# Altium schematic sheet AntiStartingCrap.SchDoc
size A4
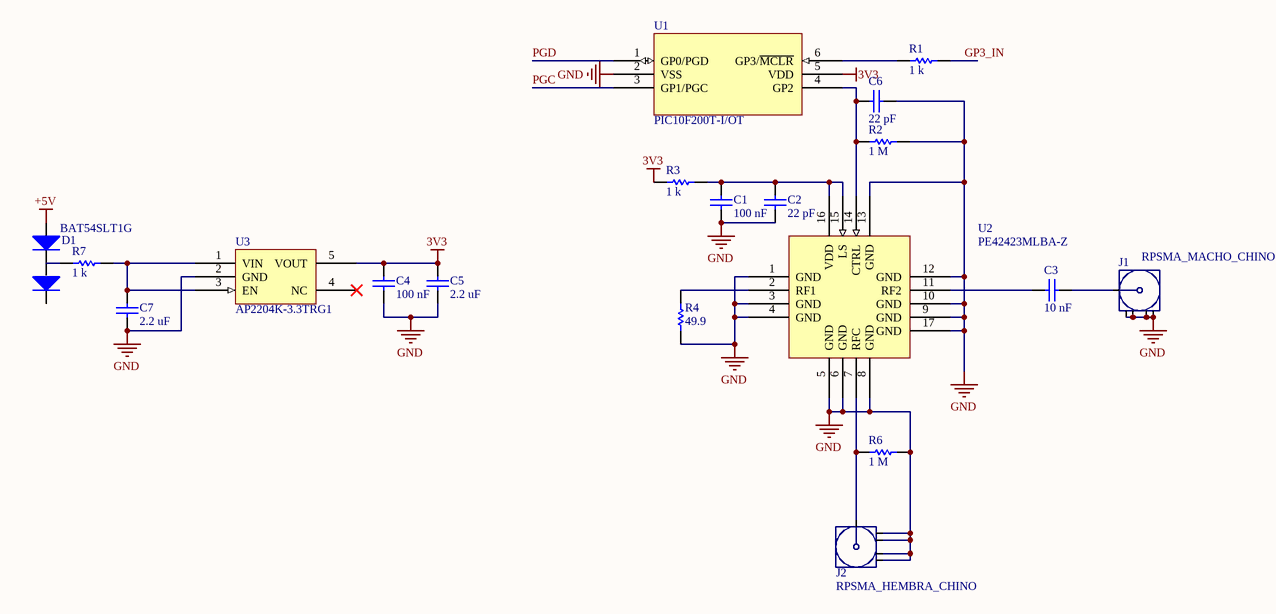
[diagram p0: AntiStartingCrap.SchDoc]

## Parts
C1  100 nF  [CAPC1608X10L]
C2  22 pF  [CAPC1608X10L]
C3  10 nF  [CAPC1608X10L]
C4  100 nF  [CAPC1608X10L]
C5  2.2 uF  [CAPC1608X10L]
C6  22 pF  [CAPC1608X10L]
C7  2.2 uF  [CAPC1608X10L]
D1  BAT54SLT1G  [SOT95P237X111-3N]
J1  RPSMA_MACHO_CHINO  [SMACHINO]
J2  RPSMA_HEMBRA_CHINO  [SMACHINO]
R1  1 k  [RESC1608X05N]
R2  1 M  [RESC1608X05N]
R3  1 k  [RESC1608X05N]
R4  49.9  [RESC1608X05N]
R6  1 M  [RESC1608X05N]
R7  1 k  [RESC1608X05N]
U1  PIC10F200T-I/OT  [SOT95P270X145-6N]
U2  PE42423MLBA-Z  [QFN50P300X300X90_HS-17N _PEREGRINE]
U3  AP2204K-3.3TRG1  [SOT95P270X145-5N]

## Nets
3V3: C4.2 C5.2 R3.1 U1.5(VDD) U3.5(VOUT)
+5V: D1.1(A)
GND: C1.1 C2.1 C4.1 C5.1 C6.1 C7.1 J1.2 J1.3 J1.4 J1.5 J2.2 J2.3 J2.4 J2.5 R2.2 R4.2 R6.2 U1.2(VSS) U2.1(GND) U2.3(GND) U2.4(GND) U2.5(GND) U2.6(GND) U2.8(GND) U2.9(GND) U2.10(GND) U2.12(GND) U2.13(GND) U2.17(GND) U3.2(GND)
GP3_IN: R1.2
PGC: U1.3(GP1/PGC)
PGD: U1.1(GP0/PGD)
NetC1_2: C1.2 C2.2 R3.2 U2.15(LS) U2.16(VDD)
NetC3_1: C3.1 J1.1
NetC3_2: C3.2 U2.11(RF2)
NetC6_2: C6.2 R2.1 U1.4(GP2) U2.14(CTRL)
NetC7_2: C7.2 R7.2 U3.1(VIN) U3.3(EN)
NetD1_3: D1.3(C) R7.1
NetJ2_1: J2.1 R6.1 U2.7(RFC)
NetR1_1: R1.1 U1.6(GP3/~{MCLR})
NetR4_1: R4.1 U2.2(RF1)

Not connected (* = marked no-connect by the designer): D1 2(K); U3 4(NC)*

## Library data of the parts
C1 C4 = CL10B104KA8NNNC: CAP CER 0.1UF 25V X7R 0603; Manufacturer: Samsung Electro-Mechanics America, Inc.; Capacitance: 0.10µF; Tolerance: ±10%; Supplier 1: Digi-Key; Manufacturer Part Number: CL10B104KA8NNNC; RoHS: RoHS Compliant; Category: Capacitors; Stock 1: 981794; Pricing 1: 1=0.09, 10=0.015, 25=0.0108, 50=0.0082, 100=0.0067, 250=0.0056, 500=0.00478, 1000=0.00376 (EUR); Packaging: Cut Tape (CT); Part Status: Active; Voltage - Rated: 25V; Temperature Coefficient: X7R; Operating Temperature: -55°C ~ 125°C; Features: -; Ratings: -; Applications: General Purpose; Failure Rate: *; Mounting Type: Surface Mount, MLCC; Package / Case: 0603 (1608 Metric); Size / Dimension: 0.063" L x 0.031" W (1.60mm x 0.80mm); Height - Seated (Max): -; Thickness (Max): 0.035" (0.90mm); Lead Spacing: -; Lead Style: -; ComponentLink1URL: http://www.samsungsem.com/kr/support/product-search/mlcc/__icsFiles/afieldfile/2016/08/18/S_CL10B104KA8NNNC.pdf; ComponentLink1Description: http://www.samsungsem.com/kr/support/product-search/mlcc/__icsFiles/afieldfile/2016/08/18/S_CL10B104KA8NNNC.pdf; Supplier Part Number 1: 1276-1006-1-ND
C2 C6 = GCM1885C1H220JA16D: CAP CER 22PF 50V NP0 0603; Manufacturer: Murata Electronics North America; Tolerance: ±5%; Temperature Coefficient: C0G, NP0; Supplier 1: Digi-Key; Manufacturer Part Number: GCM1885C1H220JA16D; RoHS: RoHS Compliant; Category: Capacitors; Stock 1: 30902; Pricing 1: 1=0.09, 10=0.038, 50=0.0204, 100=0.0173, 250=0.01416, 500=0.01212, 1000=0.00944 (EUR); Packaging: Cut Tape (CT); Part Status: Active; Capacitance: 22pF; Voltage - Rated: 50V; Operating Temperature: -55°C ~ 125°C; Features: -; Ratings: AEC-Q200; Applications: Automotive; Failure Rate: *; Mounting Type: Surface Mount, MLCC; Package / Case: 0603 (1608 Metric); Size / Dimension: 0.063" L x 0.031" W (1.60mm x 0.80mm); Height - Seated (Max): -; Thickness (Max): 0.035" (0.90mm); Lead Spacing: -; Lead Style: -; ComponentLink1URL: http://www.murata.com/~/media/webrenewal/support/library/catalog/products/capacitor/mlcc/c03e.ashx; ComponentLink1Description: http://www.murata.com/~/media/webrenewal/support/library/catalog/products/capacitor/mlcc/c03e.ashx; Supplier Part Number 1: 490-4958-1-ND
C3 = GRM1885C1H103JA01D: CAP CER 10000PF 50V NP0 0603; Manufacturer: Murata Electronics North America; Tolerance: ±5%; Temperature Coefficient: C0G, NP0; Supplier 1: Digi-Key; Manufacturer Part Number: GRM1885C1H103JA01D; RoHS: RoHS Compliant; Category: Capacitors; Stock 1: 125259; Pricing 1: 1=0.12, 10=0.079, 50=0.0454, 100=0.0376, 250=0.03164, 500=0.0265, 1000=0.02175 (EUR); Packaging: Cut Tape (CT); Part Status: Active; Capacitance: 10000pF; Voltage - Rated: 50V; Operating Temperature: -55°C ~ 125°C; Features: -; Ratings: -; Applications: General Purpose; Failure Rate: *; Mounting Type: Surface Mount, MLCC; Package / Case: 0603 (1608 Metric); Size / Dimension: 0.063" L x 0.031" W (1.60mm x 0.80mm); Height - Seated (Max): -; Thickness (Max): 0.035" (0.90mm); Lead Spacing: -; Lead Style: -; ComponentLink1URL: http://www.murata.com/~/media/webrenewal/support/library/catalog/products/capacitor/mlcc/c02e.pdf; ComponentLink1Description: http://www.murata.com/~/media/webrenewal/support/library/catalog/products/capacitor/mlcc/c02e.pdf; Supplier Part Number 1: 490-9666-1-ND
C5 C7 = GRM188R61E225MA12D: CAP CER 2.2UF 25V X5R 0603; Manufacturer: Murata Electronics North America; Capacitance: 2.2µF; Tolerance: ±20%; Supplier 1: Digi-Key; Manufacturer Part Number: GRM188R61E225MA12D; RoHS: RoHS Compliant; Category: Capacitors; Stock 1: 3943; Pricing 1: 1=0.11, 10=0.072, 50=0.0414, 100=0.0342, 250=0.02876, 500=0.0241, 1000=0.01978 (EUR); Packaging: Cut Tape (CT); Part Status: Active; Voltage - Rated: 25V; Temperature Coefficient: X5R; Operating Temperature: -55°C ~ 85°C; Features: -; Ratings: -; Applications: General Purpose; Failure Rate: *; Mounting Type: Surface Mount, MLCC; Package / Case: 0603 (1608 Metric); Size / Dimension: 0.063" L x 0.031" W (1.60mm x 0.80mm); Height - Seated (Max): -; Thickness (Max): 0.035" (0.90mm); Lead Spacing: -; Lead Style: -; Supplier Part Number 1: 490-12738-1-ND
D1 = BAT54SLT1G: Schottky Diodes & Rectifiers 30V 225mW Dual; Manufacturer: ON Semiconductor; Configuration: Dual Series; If - Forward Current: 200 mA; Ifsm - Forward Surge Current: 600 mA; Ir - Reverse Current: 2 uA at 25 V; trr - Reverse Recovery time: 5 ns; Vf - Forward Voltage: 0.8 V at 0.1 A; Supplier 1: Mouser; Manufacturer Part Number: BAT54SLT1G; RoHS: RoHS Compliant; Category: Schottky Diodes & Rectifiers; Stock 1: 52332; Pricing 1: 1=0.163, 10=0.138, 100=0.048, 1000=0.033, 3000=0.024, 24000=0.019, 45000=0.017, 99000=0.014 (EUR); Package/Case: SOT-23; Packaging: Reel; Product: Schottky Diodes; Series: BAT54SL; Technology: Si; Brand: ON Semiconductor; Mounting Style: SMD/SMT; Maximum Operating Temperature: + 150 C; Minimum Operating Temperature: - 55 C; Product Category: Diodes- Schottky; Standard Pack Qty: 3000; Vrrm - Repetitive Reverse Voltage: 30 V; RoHS - Mouser: Y; Minimum Order Quantity: 1; Reeling: True; ComponentLink1URL: http://www.mouser.com/ds/2/308/BAT54SLT1-D-103997.pdf; ComponentLink1Description: http://www.mouser.com/ds/2/308/BAT54SLT1-D-103997.pdf; Supplier Part Number 1: 863-BAT54SLT1G
R1 R3 R7 = CRCW06031K00FKEA: Thick Film Resistors - SMD 1/10watt 1.0Kohms 1%; Manufacturer: Vishay / Dale; Power Rating: 100 mW; Resistance: 1 kOhms; Temperature Coefficient: 100 PPM / K; Voltage Rating: 75 V; Supplier 1: Mouser; Manufacturer Part Number: CRCW06031K00FKEA; RoHS: RoHS Compliant By Exemption; Category: Thick Film Resistors - SMD; Stock 1: 732868; Pricing 1: 1=0.091, 10=0.040, 100=0.024, 500=0.019, 1000=0.016, 5000=0.005, 50000=0.004 (EUR); Height: 0.45 mm; Length: 1.55 mm; Operating Temperature Range: - 55 C to + 155 C; Package/Case: 0603 (1608 metric); Packaging: Reel; Product: Thick Film Resistors SMD; Series: CRCW; Termination Style: SMD/SMT; Tolerance: 1 %; Width: 0.85 mm; Brand: Vishay / Dale; Case Code - in: 0603; Case Code - mm: 1608; Product Category: 0603 Thick Film Chip Resistors; Standard Pack Qty: 5000; RoHS - Mouser: E; Minimum Order Quantity: 1; Reeling: True; ComponentLink1URL: http://www.mouser.com/ds/2/427/dcrcwe3-109170.pdf; ComponentLink1Description: http://www.mouser.com/ds/2/427/dcrcwe3-109170.pdf; Supplier Part Number 1: 71-CRCW0603-1.0K-E3
R2 R6 = CRCW06031M00FKEA: Thick Film Resistors - SMD 1/10watt 1.0Mohms 1%; Manufacturer: Vishay / Dale; Power Rating: 100 mW; Resistance: 1 MOhms; Temperature Coefficient: 100 PPM / K; Voltage Rating: 75 V; Supplier 1: Mouser; Manufacturer Part Number: CRCW06031M00FKEA; RoHS: RoHS Compliant By Exemption; Category: Thick Film Resistors - SMD; Stock 1: 156208; Pricing 1: 1=0.091, 10=0.040, 100=0.024, 500=0.019, 1000=0.016, 5000=0.005, 50000=0.004 (EUR); Height: 0.45 mm; Length: 1.55 mm; Operating Temperature Range: - 55 C to + 155 C; Package/Case: 0603 (1608 metric); Packaging: Reel; Product: Thick Film Resistors SMD; Series: CRCW; Termination Style: SMD/SMT; Tolerance: 1 %; Width: 0.85 mm; Brand: Vishay / Dale; Case Code - in: 0603; Case Code - mm: 1608; Product Category: 0603 Thick Film Chip Resistors; Standard Pack Qty: 5000; RoHS - Mouser: E; Minimum Order Quantity: 1; Reeling: True; ComponentLink1URL: http://www.mouser.com/ds/2/427/dcrcwe3-109170.pdf; ComponentLink1Description: http://www.mouser.com/ds/2/427/dcrcwe3-109170.pdf; Supplier Part Number 1: 71-CRCW0603-1.0M-E3
R4 = CRCW060349R9FKEA: RES SMD 49.9 OHM 1% 1/10W 0603; Manufacturer: Vishay Dale; Power (Watts): 0.1W, 1/10W; Temperature Coefficient: ±100ppm/°C; Supplier 1: Digi-Key; Manufacturer Part Number: CRCW060349R9FKEA; RoHS: RoHS Compliant; Category: Resistors; Stock 1: 154553; Pricing 1: 1=0.09, 10=0.027, 25=0.0196, 50=0.0152, 100=0.0111, 250=0.00844, 500=0.00676, 1000=0.00498, 2500=0.00432 (EUR); Packaging: Cut Tape (CT); Part Status: Active; Resistance (Ohms): 49.9; Tolerance: ±1%; Composition: Thick Film; Features: Automotive AEC-Q200; Operating Temperature: -55°C ~ 155°C; Package / Case: 0603 (1608 Metric); Supplier Device Package: 0603; Size / Dimension: 0.063" L x 0.033" W (1.60mm x 0.85mm); Height - Seated (Max): 0.020" (0.50mm); Number of Terminations: 2; Failure Rate: -; ComponentLink1URL: http://www.vishay.com/docs/20035/dcrcwe3.pdf; ComponentLink1Description: http://www.vishay.com/docs/20035/dcrcwe3.pdf; Supplier Part Number 1: 541-49.9HCT-ND
U1 = PIC10F200T-I/OT: IC MCU 8BIT 384B FLASH SOT23-6; Manufacturer: Microchip Technology; Core Processor: PIC; Core Size: 8-Bit; Speed: 4MHz; Peripherals: POR, WDT; Number of I/O: 3; Program Memory Size: 384B (256 x 12); RAM Size: 16 x 8; Voltage - Supply (Vcc/Vdd): 2 V ~ 5.5 V; Oscillator Type: Internal; Supplier 1: Digi-Key; Manufacturer Part Number: PIC10F200T-I/OT; RoHS: RoHS Compliant; Category: Integrated Circuits (ICs); Stock 1: 52053; Pricing 1: 1=0.38, 25=0.3504, 100=0.3146 (EUR); Packaging: Cut Tape (CT); Part Status: Active; Connectivity: -; Program Memory Type: FLASH; EEPROM Size: -; Data Converters: -; Operating Temperature: -40°C ~ 85°C (TA); Package / Case: SOT-23-6; Supplier Device Package: SOT-23-6; ComponentLink1URL: http://www.microchip.com/mymicrochip/filehandler.aspx?ddocname=en020112; ComponentLink1Description: http://www.microchip.com/mymicrochip/filehandler.aspx?ddocname=en020112; Supplier Part Number 1: PIC10F200T-I/OTCT-ND
U2 = PE42423MLBA-Z: IC RF SWITCH SPDT 50 OHM 16QFN; Manufacturer: Peregrine Semiconductor; Frequency - Lower: 100MHz; Frequency - Upper: 6GHz; Isolation @ Frequency: 41dB @ 6GHz (typ); Insertion Loss @ Frequency: 0.95dB @ 6GHz; IIP3: 65dBm (typ); Topology: Absorptive; Impedance: 50 Ohm; Voltage - Supply: 2.3 V ~ 5.5 V; RF Type: 802.11a/b/g/n/ac; Supplier 1: Digi-Key; Manufacturer Part Number: PE42423MLBA-Z; RoHS: RoHS Compliant; Category: RF/IF and RFID; Stock 1: 64113; Pricing 1: 1=1.79, 101=1.2499 (EUR); Packaging: Cut Tape (CT); Part Status: Active; Circuit: SPDT; P1dB: -; Features: -; Operating Temperature: -40°C ~ 85°C; Package / Case: 16-VFQFN Exposed Pad; Supplier Device Package: 16-QFN (3x3); ComponentLink1URL: http://www.psemi.com/pdf/datasheets/pe42423ds.pdf; ComponentLink1Description: http://www.psemi.com/pdf/datasheets/pe42423ds.pdf; Supplier Part Number 1: 1046-1103-1-ND
U3 = AP2204K-3.3TRG1: IC REG LDO 3.3V 0.15A SOT25; Manufacturer: Diodes Incorporated; Regulator Topology: Positive Fixed; Current - Output: 150mA; Voltage - Dropout (Typical): 0.36V @ 150mA; Number of Regulators: 1; Voltage - Input: Up to 24V; Supplier 1: Digi-Key; Manufacturer Part Number: AP2204K-3.3TRG1; RoHS: RoHS Compliant; Category: Integrated Circuits (ICs); Stock 1: 9134; Pricing 1: 1=0.4, 10=0.326, 100=0.2219, 500=0.16644, 1000=0.12483 (EUR); Packaging: Cut Tape (CT); Part Status: Active; Voltage - Output: 3.3V; Current - Limit (Min): -; Operating Temperature: -40°C ~ 85°C; Mounting Type: Surface Mount; Package / Case: SC-74A, SOT-753; Supplier Device Package: SOT-23-5; ComponentLink1URL: http://www.diodes.com/_files/datasheets/AP2204.pdf; ComponentLink1Description: http://www.diodes.com/_files/datasheets/AP2204.pdf; Supplier Part Number 1: AP2204K-3.3TRG1DICT-ND